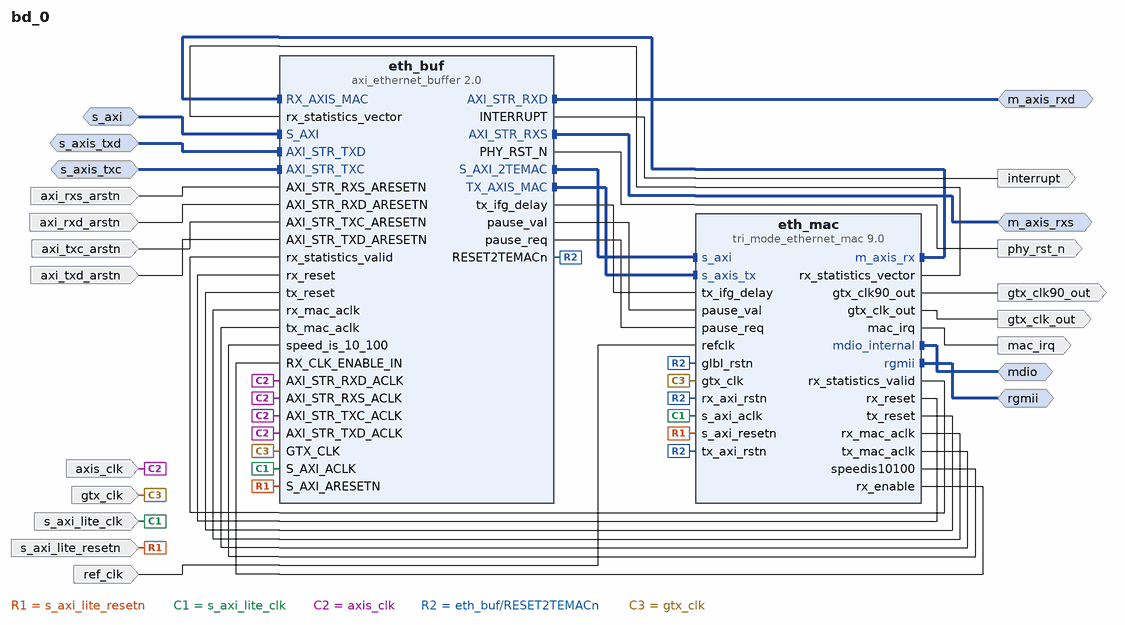
[diagram p0: block diagram of the top level]
# Vivado block design bd_0, Vivado 2015.2
create_bd_design bd_0

create_bd_intf_port -mode Slave -vlnv xilinx.com:interface:aximm_rtl:1.0 s_axi
set_property -dict {CONFIG.DATA_WIDTH 32 CONFIG.PROTOCOL AXI4LITE} [get_bd_intf_ports s_axi]
create_bd_intf_port -mode Slave -vlnv xilinx.com:interface:axis_rtl:1.0 s_axis_txd
create_bd_intf_port -mode Slave -vlnv xilinx.com:interface:axis_rtl:1.0 s_axis_txc
create_bd_intf_port -mode Master -vlnv xilinx.com:interface:axis_rtl:1.0 m_axis_rxd
create_bd_intf_port -mode Master -vlnv xilinx.com:interface:axis_rtl:1.0 m_axis_rxs
create_bd_intf_port -mode Master -vlnv xilinx.com:interface:mdio_rtl:1.0 mdio
set_property -dict {CONFIG.BOARD.ASSOCIATED_PARAM MDIO_BOARD_INTERFACE} [get_bd_intf_ports mdio]
create_bd_intf_port -mode Master -vlnv xilinx.com:interface:rgmii_rtl:1.0 rgmii
set_property -dict {CONFIG.BOARD.ASSOCIATED_PARAM ETHERNET_BOARD_INTERFACE} [get_bd_intf_ports rgmii]
create_bd_port -dir I -type rst s_axi_lite_resetn
set_property -dict {CONFIG.POLARITY ACTIVE_LOW} [get_bd_ports s_axi_lite_resetn]
create_bd_port -dir I -type rst axi_rxs_arstn
set_property -dict {CONFIG.POLARITY ACTIVE_LOW} [get_bd_ports axi_rxs_arstn]
create_bd_port -dir I -type rst axi_rxd_arstn
set_property -dict {CONFIG.POLARITY ACTIVE_LOW} [get_bd_ports axi_rxd_arstn]
create_bd_port -dir I -type rst axi_txc_arstn
set_property -dict {CONFIG.POLARITY ACTIVE_LOW} [get_bd_ports axi_txc_arstn]
create_bd_port -dir I -type rst axi_txd_arstn
set_property -dict {CONFIG.POLARITY ACTIVE_LOW} [get_bd_ports axi_txd_arstn]
create_bd_port -dir I -type clk s_axi_lite_clk
create_bd_port -dir I -type clk axis_clk
create_bd_port -dir O -type intr interrupt
set_property -dict {CONFIG.SENSITIVITY LEVEL_HIGH} [get_bd_ports interrupt]
create_bd_port -dir O -type intr mac_irq
set_property -dict {CONFIG.SENSITIVITY EDGE_RISING} [get_bd_ports mac_irq]
create_bd_port -dir O -type rst phy_rst_n
set_property -dict {CONFIG.POLARITY ACTIVE_LOW CONFIG.BOARD.ASSOCIATED_PARAM PHYRST_BOARD_INTERFACE} [get_bd_ports phy_rst_n]
create_bd_port -dir I -type clk gtx_clk
set_property -dict {CONFIG.FREQ_HZ 125000000} [get_bd_ports gtx_clk]
create_bd_port -dir O -type clk gtx_clk_out
create_bd_port -dir O -type clk gtx_clk90_out
create_bd_port -dir I -type clk ref_clk

create_bd_cell -type ip -vlnv xilinx.com:ip:axi_ethernet_buffer:2.0 eth_buf
set_property -dict [list \
  CONFIG.USE_BOARD_FLOW true \
  CONFIG.PHYRST_BOARD_INTERFACE phy_reset_out \
  CONFIG.HAS_SGMII false \
  CONFIG.TXMEM 32k \
  CONFIG.RXMEM 32k \
  CONFIG.TXCSUM Full \
  CONFIG.RXCSUM Full \
  CONFIG.C_TYPE 1 \
  CONFIG.C_PHYADDR 1 \
  CONFIG.C_PHY_TYPE 3 \
  CONFIG.C_STATS 1 \
  CONFIG.C_AVB 0 \
  CONFIG.TXVLAN_TRAN false \
  CONFIG.RXVLAN_TRAN false \
  CONFIG.TXVLAN_TAG false \
  CONFIG.RXVLAN_TAG false \
  CONFIG.TXVLAN_STRP false \
  CONFIG.RXVLAN_STRP false \
  CONFIG.MCAST_EXTEND false \
  CONFIG.SIMULATION_MODE false \
  CONFIG.ENABLE_LVDS 0 \
] [get_bd_cells eth_buf]
create_bd_cell -type ip -vlnv xilinx.com:ip:tri_mode_ethernet_mac:9.0 eth_mac
set_property -dict [list \
  CONFIG.USE_BOARD_FLOW true \
  CONFIG.ETHERNET_BOARD_INTERFACE rgmii \
  CONFIG.MDIO_BOARD_INTERFACE mdio_mdc \
  CONFIG.Data_Rate 1_Gbps \
  CONFIG.Physical_Interface RGMII \
  CONFIG.MAC_Speed Tri_speed \
  CONFIG.Half_Duplex false \
  CONFIG.Management_Interface true \
  CONFIG.Enable_MDIO true \
  CONFIG.Make_MDIO_External false \
  CONFIG.Frame_Filter true \
  CONFIG.Number_of_Table_Entries 4 \
  CONFIG.Statistics_Counters true \
  CONFIG.Statistics_Reset false \
  CONFIG.Statistics_Width 64bit \
  CONFIG.Enable_AVB false \
  CONFIG.Enable_1588 false \
  CONFIG.Enable_1588_1step false \
  CONFIG.Timer_Format Time_of_day \
  CONFIG.SupportLevel 1 \
  CONFIG.Enable_Priority_Flow_Control false \
] [get_bd_cells eth_mac]

# ---- connections ----

connect_bd_intf_net [get_bd_intf_pins eth_buf/S_AXI_2TEMAC] [get_bd_intf_pins eth_mac/s_axi]
connect_bd_intf_net [get_bd_intf_pins eth_buf/RX_AXIS_MAC] [get_bd_intf_pins eth_mac/m_axis_rx]
connect_bd_intf_net [get_bd_intf_pins eth_buf/TX_AXIS_MAC] [get_bd_intf_pins eth_mac/s_axis_tx]
connect_bd_intf_net [get_bd_intf_ports s_axi] [get_bd_intf_pins eth_buf/S_AXI]
connect_bd_intf_net [get_bd_intf_ports s_axis_txd] [get_bd_intf_pins eth_buf/AXI_STR_TXD]
connect_bd_intf_net [get_bd_intf_ports s_axis_txc] [get_bd_intf_pins eth_buf/AXI_STR_TXC]
connect_bd_intf_net [get_bd_intf_ports m_axis_rxd] [get_bd_intf_pins eth_buf/AXI_STR_RXD]
connect_bd_intf_net [get_bd_intf_ports m_axis_rxs] [get_bd_intf_pins eth_buf/AXI_STR_RXS]
connect_bd_intf_net [get_bd_intf_ports mdio] [get_bd_intf_pins eth_mac/mdio_internal]
connect_bd_intf_net [get_bd_intf_ports rgmii] [get_bd_intf_pins eth_mac/rgmii]
connect_bd_net [get_bd_ports s_axi_lite_resetn] [get_bd_pins eth_buf/S_AXI_ARESETN] [get_bd_pins eth_mac/s_axi_resetn]
connect_bd_net [get_bd_ports axi_rxs_arstn] [get_bd_pins eth_buf/AXI_STR_RXS_ARESETN]
connect_bd_net [get_bd_ports axi_rxd_arstn] [get_bd_pins eth_buf/AXI_STR_RXD_ARESETN]
connect_bd_net [get_bd_ports axi_txc_arstn] [get_bd_pins eth_buf/AXI_STR_TXC_ARESETN]
connect_bd_net [get_bd_ports axi_txd_arstn] [get_bd_pins eth_buf/AXI_STR_TXD_ARESETN]
connect_bd_net [get_bd_ports s_axi_lite_clk] [get_bd_pins eth_buf/S_AXI_ACLK] [get_bd_pins eth_mac/s_axi_aclk]
connect_bd_net [get_bd_ports axis_clk] \
  [get_bd_pins eth_buf/AXI_STR_RXS_ACLK] [get_bd_pins eth_buf/AXI_STR_RXD_ACLK] [get_bd_pins eth_buf/AXI_STR_TXC_ACLK] \
  [get_bd_pins eth_buf/AXI_STR_TXD_ACLK]
connect_bd_net [get_bd_pins eth_mac/rx_statistics_vector] [get_bd_pins eth_buf/rx_statistics_vector]
connect_bd_net [get_bd_pins eth_mac/rx_statistics_valid] [get_bd_pins eth_buf/rx_statistics_valid]
connect_bd_net [get_bd_pins eth_buf/tx_ifg_delay] [get_bd_pins eth_mac/tx_ifg_delay]
connect_bd_net [get_bd_pins eth_buf/pause_val] [get_bd_pins eth_mac/pause_val]
connect_bd_net [get_bd_pins eth_buf/pause_req] [get_bd_pins eth_mac/pause_req]
connect_bd_net [get_bd_pins eth_mac/rx_reset] [get_bd_pins eth_buf/rx_reset]
connect_bd_net [get_bd_pins eth_mac/tx_reset] [get_bd_pins eth_buf/tx_reset]
connect_bd_net [get_bd_pins eth_mac/rx_mac_aclk] [get_bd_pins eth_buf/rx_mac_aclk]
connect_bd_net [get_bd_pins eth_mac/tx_mac_aclk] [get_bd_pins eth_buf/tx_mac_aclk]
connect_bd_net [get_bd_pins eth_buf/RESET2TEMACn] [get_bd_pins eth_mac/glbl_rstn] [get_bd_pins eth_mac/tx_axi_rstn] [get_bd_pins eth_mac/rx_axi_rstn]
connect_bd_net [get_bd_pins eth_buf/INTERRUPT] [get_bd_ports interrupt]
connect_bd_net [get_bd_pins eth_mac/mac_irq] [get_bd_ports mac_irq]
connect_bd_net [get_bd_pins eth_buf/PHY_RST_N] [get_bd_ports phy_rst_n]
connect_bd_net [get_bd_pins eth_mac/speedis10100] [get_bd_pins eth_buf/speed_is_10_100]
connect_bd_net [get_bd_pins eth_mac/rx_enable] [get_bd_pins eth_buf/RX_CLK_ENABLE_IN]
connect_bd_net [get_bd_ports gtx_clk] [get_bd_pins eth_mac/gtx_clk] [get_bd_pins eth_buf/GTX_CLK]
connect_bd_net [get_bd_pins eth_mac/gtx_clk_out] [get_bd_ports gtx_clk_out]
connect_bd_net [get_bd_pins eth_mac/gtx_clk90_out] [get_bd_ports gtx_clk90_out]
connect_bd_net [get_bd_ports ref_clk] [get_bd_pins eth_mac/refclk]

# ---- address map ----
assign_bd_address -offset 0x00000 -range 4K -target_address_space [get_bd_addr_spaces eth_buf/S_AXI_2TEMAC] [get_bd_addr_segs eth_mac/s_axi/Reg]
assign_bd_address -offset 0x00000 -range 256K -target_address_space [get_bd_addr_spaces s_axi] [get_bd_addr_segs eth_buf/S_AXI/Reg]

validate_bd_design
save_bd_design
